# EAGLE design ASL1101 (EAGLE 6.3)
DATABASE: ./../../../../../Components/TinyCircuits_Part_Database.txt
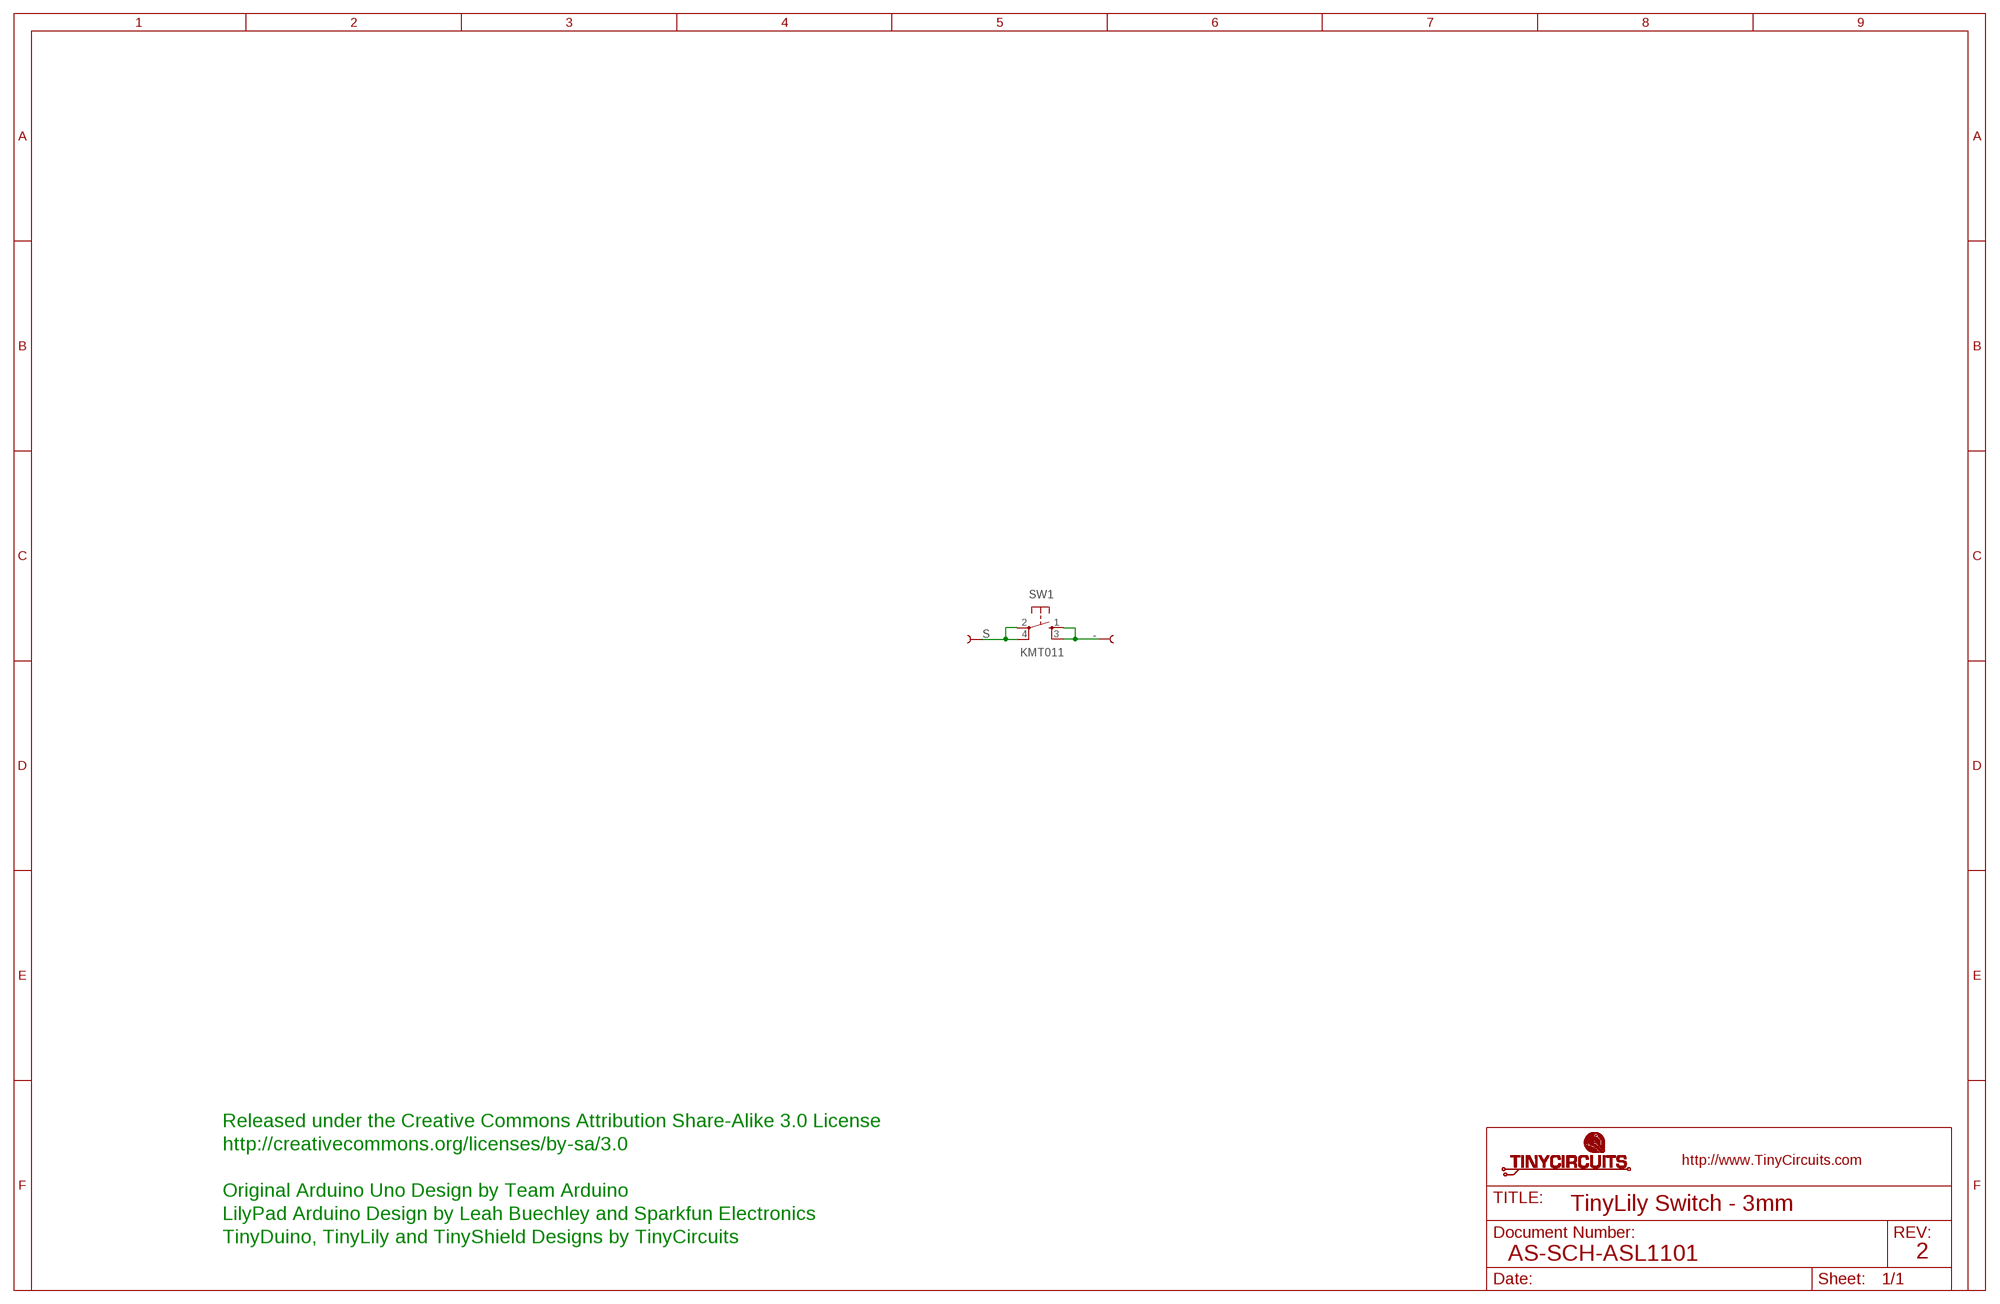
[diagram p0: schematic, sheet 1]

## Parts
SW1  KMT011  AS-ITM-00041  [KMT011]
U$1  SEWTABTH_1206  [SEWTAP_TH_1206]
U$7  SEWTABTH_1206  [SEWTAP_TH_1206]

## Nets
-: SW1.1 SW1.3 U$1.1
S: SW1.2 SW1.4 U$7.1

## Notes on the sheet
- Released under the Creative Commons Attribution Share-Alike 3.0 License
- http://creativecommons.org/licenses/by-sa/3.0
- Original Arduino Uno Design by Team Arduino
- TinyLily Switch - 3mm
- LilyPad Arduino Design by Leah Buechley and Sparkfun Electronics
- TinyDuino, TinyLily and TinyShield Designs by TinyCircuits
- AS-SCH-ASL1101 | 2

## Library data of the parts
SW1 = tinycircuits:AS-ITM-00041: SWITCH TACTILE SPST-NO 0.05A 32V; PARTNO: AS-ITM-00041
U$1 U$7 = tinycircuits:SEWTAB: TinyLily Sew Tab; BOM: EXCLUDE; DNP: T

## Board
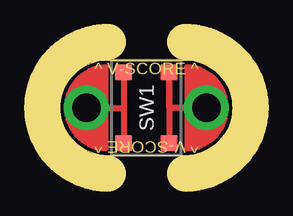
[diagram p1: board, top side]
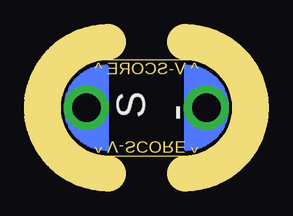
[diagram p2: board, bottom side, seen from below]

Size 7.2 x 4 mm. Coordinates in mm from the lower left corner, seen from the top.
Outline: 0,4 7.2,4
Outline: 7.2,0 0,0
Outline: 5.2,0 2,0 arc-180 2,4 5.2,4 arc-180 5.2,0
Copper layers (1*16): Top 0.035mm / dielectric 1.5mm / Bottom 0.035mm
Design rules "default": minimum track width 8mil, minimum drill 15mil, track to track 6mil, track to pad 6mil, pad to pad 6mil, via to via 6mil, smd to smd 6mil, copper to edge 6mil, drill to drill 8mil, minimum pad ring 8mil, minimum via ring 5mil, stop-mask expansion 4mil, vias tented up to drill 25mil, thermal gap 10mil
Milling: 2 lines

### Footprints (pad centres in the part's own frame; a part is rotated, then mirrored left to right if it is on the bottom)
KMT011 = smd 0.65 x 0.7: 1 -1.475,0.95; 2 -1.475,-0.95; 3 1.475,0.95; 4 1.475,-0.95
SEWTAP_TH_1206 = drill 1.2 pad 1.867: 1 0,0

### Placement (x,y rotation side)
SW1  3.6,2 90 top
U$1  1.1,2 180 bottom
U$6  [DOCFIELD-TINYCIRCUITS-PCB]  27.6,-18 0 top  (outside the outline)
U$7  6.1,2 0 bottom

### Tracks (layer width: path | path; a pad name or v marks a point on that pad's centre or on a via)
-
  Top 0.254: SW1.3 2.65,2 | 2.65,2 SW1.1 | U$1.1 2.65,2
S
  Top 0.254: U$7.1 4.55,2 SW1.4 SW1.2

### Text on the board
Dimension: ^ V-SCORE ^ | ^ V-SCORE ^
bPlace: S | -
Document: FABRICATION DRAWING | NOTES: | 1. PRINTED CIRCUIT BOARD MADE FROM NEMA GRADE FR-4 EPOXY LAMINATE | WITH 1 OUNCE COPPER PLATING AND .024 THICKNESS. | 2. ALL DIMENSIONS ARE GIVEN IN INCHES. | 3. CIRCUIT PATHS ARE FOR REFERENCE ONLY. | 4. HOLE SIZES SHOWN ARE FINISHED DIAMETERS AFTER PLATING. | 5. BOARD PLATED USING REFLOW OR SIMILAR METHOD. | 6. BOARD TO HAVE BLUE SOLDER MASK ON PLATED SURFACES USING WET FILM | 7. SILKSCREEN BOARD USING WHITE INK. | SR100 OR SR1010 EPOXY. EQUIVALENT WET OR DRY FILM MAY BE USED. | 8. THE FOLLOWING INFORMATION APPLIES TO THIS BOARD: | * 2 COPPER LAYERS | * .024 BOARD THICKNESS | * REQUIRES TOP SIDE SILKSCREEN | Released under the Creative Commons Attribution Share-Alike 3.0 License | http://creativecommons.org/licenses/by-sa/3.0 | LilyPad Arduino Design by Leah Buechley and Sparkfun Electronics | Original Arduino Uno Design by Team Arduino | TinyDuino, TinyLily and TinyShield Designs by TinyCircuits | TinyLily Switch - 3mm | AS-PCB-ASL1101 | 2